# EAGLE schematic subalfie (EAGLE 6.2)
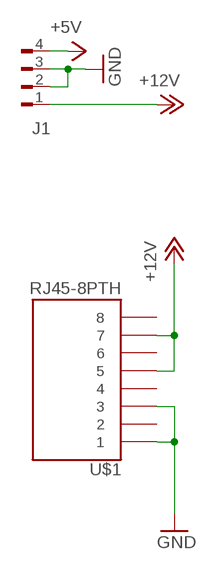
[diagram p0: schematic, sheet 1]

## Parts
J1  FLOPPY-4350211  [350211]
U$1  RJ45-8PTH  [RJ45-8]

## Nets
+5V: J1.4
+12V: J1.1 U$1.5 U$1.7
GND: J1.2 J1.3 U$1.1 U$1.3
Unconnected: U$1.2 U$1.4 U$1.6 U$1.8

## Library data of the parts
J1 = con-amp:FLOPPY-4: MATE N-LOCK Floppy / HDD conector Distributor: Bürklin 71F970
U$1 = SparkFun:RJ45-8: RJ45 Jack Simple RJ45, 8-pin connection - connector for common Cat5, Cat5e, and Cat6 Ethernet cables. Footprint not yet proven in production. Connector sku is PRT-00643; Breakout PCB sku is BOB-00716.